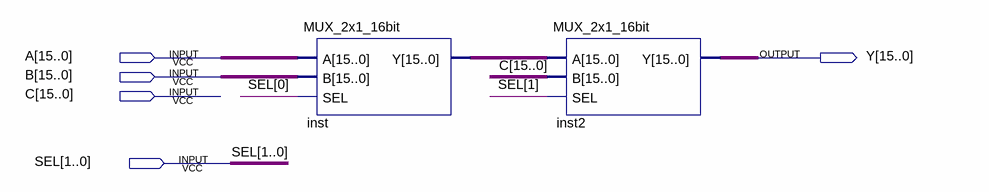
[diagram p0: schematic sheet]
// Quartus schematic MUX_3x1_16bit.bdf as structural Verilog: 2 symbols, 5 pins
module MUX_3x1_16bit (
  input  [15:0] A,
  input  [15:0] B,
  input  [15:0] C,
  input  [1:0] SEL,
  output [15:0] Y
);

  wire [15:0] inst_y;

  MUX_2x1_16bit inst (.A(A), .B(B), .SEL(SEL[0]), .Y(inst_y));
  MUX_2x1_16bit inst2 (.A(inst_y), .B(C), .SEL(SEL[1]), .Y(Y));
endmodule
